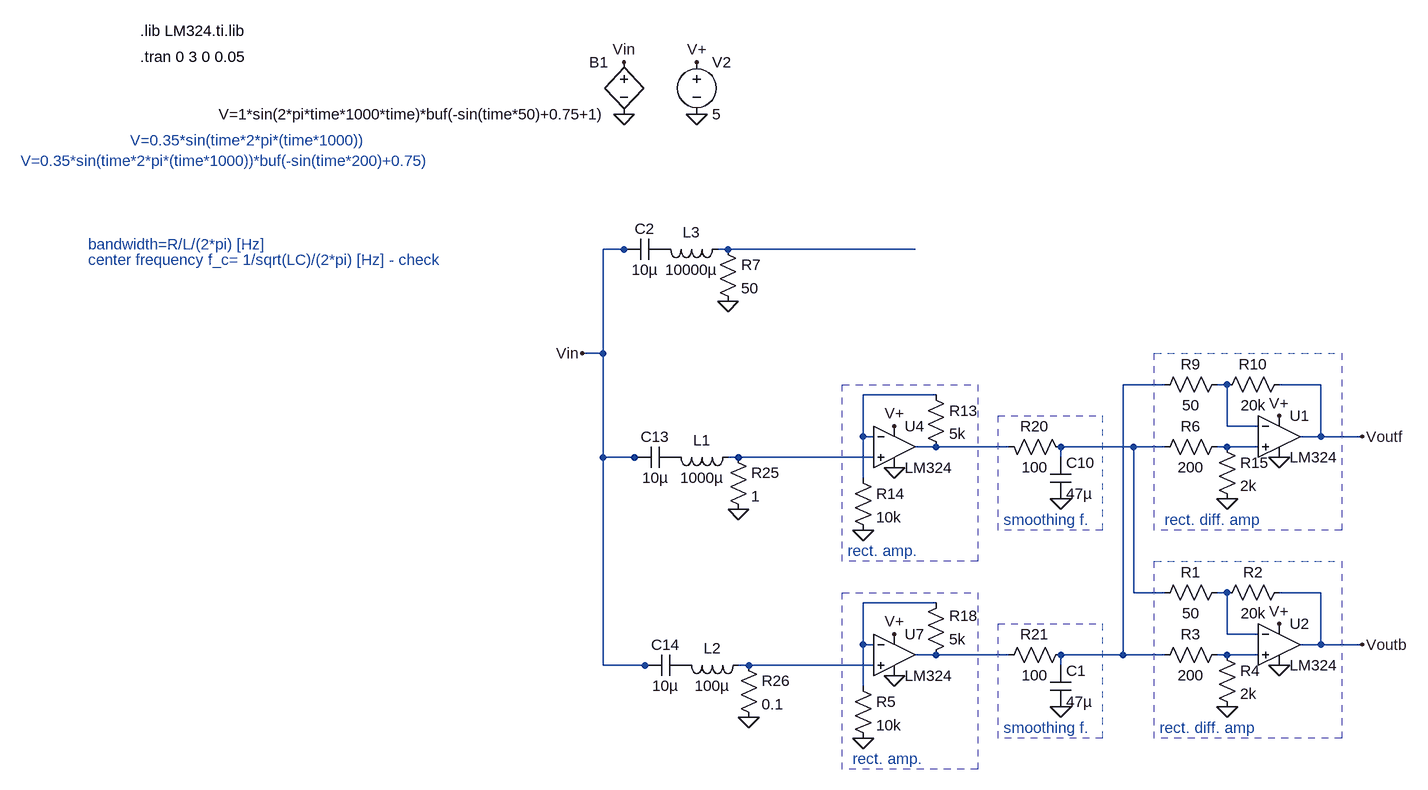
[diagram p0: schematic circuit-rlc.asc]
circuit-rlc.asc, the LTspice schematic file:
Version 4
SHEET 1 1988 1492
WIRE -336 64 -368 64
WIRE -320 64 -336 64
WIRE -176 64 -192 64
WIRE 112 64 -176 64
WIRE -368 224 -368 64
WIRE -368 224 -400 224
WIRE 496 272 432 272
WIRE 592 272 576 272
WIRE 736 272 672 272
WIRE 144 288 32 288
WIRE 592 336 592 272
WIRE 640 336 592 336
WIRE 32 352 32 288
WIRE 48 352 32 352
WIRE 736 352 736 272
WIRE 736 352 704 352
WIRE 800 352 736 352
WIRE 144 368 112 368
WIRE 256 368 144 368
WIRE 448 368 336 368
WIRE 496 368 448 368
WIRE 592 368 576 368
WIRE 640 368 592 368
WIRE -368 384 -368 224
WIRE -320 384 -368 384
WIRE -304 384 -320 384
WIRE -160 384 -176 384
WIRE 48 384 -160 384
WIRE 336 384 336 368
WIRE 32 416 32 352
WIRE 448 592 448 368
WIRE 496 592 448 592
WIRE 592 592 576 592
WIRE 736 592 672 592
WIRE 144 608 32 608
WIRE 592 656 592 592
WIRE 640 656 592 656
WIRE 32 672 32 608
WIRE 48 672 32 672
WIRE 736 672 736 592
WIRE 736 672 704 672
WIRE 800 672 736 672
WIRE 144 688 112 688
WIRE 256 688 144 688
WIRE 432 688 432 272
WIRE 432 688 336 688
WIRE 496 688 432 688
WIRE 592 688 576 688
WIRE 640 688 592 688
WIRE -368 704 -368 384
WIRE -304 704 -368 704
WIRE -288 704 -304 704
WIRE -144 704 -160 704
WIRE 48 704 -144 704
WIRE 336 704 336 688
WIRE 32 736 32 672
FLAG -336 -144 0
FLAG -224 -144 0
FLAG -224 -224 V+
FLAG 80 400 0
FLAG 32 496 0
FLAG 80 336 V+
FLAG 80 720 0
FLAG 32 816 0
FLAG 80 656 V+
FLAG 336 448 0
FLAG 336 768 0
FLAG 672 384 0
FLAG 672 320 V+
FLAG 800 352 Voutf
FLAG 592 448 0
FLAG 672 704 0
FLAG 672 640 V+
FLAG 800 672 Voutb
FLAG 592 768 0
FLAG -336 -224 Vin
FLAG -400 224 Vin
FLAG -160 464 0
FLAG -144 784 0
FLAG -176 144 0
SYMBOL voltage -224 -240 R0
WINDOW 123 0 0 Left 2
WINDOW 39 0 0 Left 2
SYMATTR InstName V2
SYMATTR Value 5
SYMBOL bv -336 -240 M0
SYMATTR InstName B1
SYMATTR Value V=1*sin(2*pi*time*1000*time)*buf(-sin(time*50)+0.75+1)
SYMBOL Opamps\\opamp2 80 304 R0
SYMATTR InstName U4
SYMATTR Value LM324
SYMBOL res 128 272 R0
SYMATTR InstName R13
SYMATTR Value 5k
SYMBOL res 16 400 R0
SYMATTR InstName R14
SYMATTR Value 10k
SYMBOL Opamps\\opamp2 80 624 R0
SYMATTR InstName U7
SYMATTR Value LM324
SYMBOL res 128 704 M180
WINDOW 0 36 76 Left 2
WINDOW 3 36 40 Left 2
SYMATTR InstName R18
SYMATTR Value 5k
SYMBOL res 352 384 M270
WINDOW 0 32 56 VTop 2
WINDOW 3 0 56 VBottom 2
SYMATTR InstName R20
SYMATTR Value 100
SYMBOL cap 320 448 M180
WINDOW 0 24 56 Left 2
WINDOW 3 24 8 Left 2
SYMATTR InstName C10
SYMATTR Value 47µ
SYMBOL res 352 672 R90
WINDOW 0 0 56 VBottom 2
WINDOW 3 32 56 VTop 2
SYMATTR InstName R21
SYMATTR Value 100
SYMBOL res 16 720 R0
SYMATTR InstName R5
SYMATTR Value 10k
SYMBOL Opamps\\opamp2 672 288 R0
SYMATTR InstName U1
SYMATTR Value LM324
SYMBOL res 592 256 R90
WINDOW 0 0 56 VBottom 2
WINDOW 3 32 56 VTop 2
SYMATTR InstName R9
SYMATTR Value 50
SYMBOL res 688 256 R90
WINDOW 0 0 56 VBottom 2
WINDOW 3 32 56 VTop 2
SYMATTR InstName R10
SYMATTR Value 20k
SYMBOL res 576 352 R0
SYMATTR InstName R15
SYMATTR Value 2k
SYMBOL Opamps\\opamp2 672 608 R0
SYMATTR InstName U2
SYMATTR Value LM324
SYMBOL res 592 576 R90
WINDOW 0 0 56 VBottom 2
WINDOW 3 32 56 VTop 2
SYMATTR InstName R1
SYMATTR Value 50
SYMBOL res 688 576 R90
WINDOW 0 0 56 VBottom 2
WINDOW 3 32 56 VTop 2
SYMATTR InstName R2
SYMATTR Value 20k
SYMBOL res 592 672 R90
WINDOW 0 0 56 VBottom 2
WINDOW 3 32 56 VTop 2
SYMATTR InstName R3
SYMATTR Value 200
SYMBOL res 576 672 R0
SYMATTR InstName R4
SYMATTR Value 2k
SYMBOL res 592 352 R90
WINDOW 0 0 56 VBottom 2
WINDOW 3 32 56 VTop 2
SYMATTR InstName R6
SYMATTR Value 200
SYMBOL cap 320 704 R0
SYMATTR InstName C1
SYMATTR Value 47µ
SYMBOL cap -256 368 R90
WINDOW 0 0 32 VBottom 2
WINDOW 3 32 32 VTop 2
SYMATTR InstName C13
SYMATTR Value 10µ
SYMBOL ind -160 368 R90
WINDOW 0 5 56 VBottom 2
WINDOW 3 32 56 VTop 2
SYMATTR InstName L1
SYMATTR Value 1000µ
SYMBOL res -176 368 R0
SYMATTR InstName R25
SYMATTR Value 1
SYMBOL cap -240 688 R90
WINDOW 0 0 32 VBottom 2
WINDOW 3 32 32 VTop 2
SYMATTR InstName C14
SYMATTR Value 10µ
SYMBOL ind -144 688 R90
WINDOW 0 5 56 VBottom 2
WINDOW 3 32 56 VTop 2
SYMATTR InstName L2
SYMATTR Value 100µ
SYMBOL res -160 688 R0
SYMATTR InstName R26
SYMATTR Value 0.1
SYMBOL cap -272 48 R90
WINDOW 0 0 32 VBottom 2
WINDOW 3 32 32 VTop 2
SYMATTR InstName C2
SYMATTR Value 10µ
SYMBOL ind -176 48 R90
WINDOW 0 5 56 VBottom 2
WINDOW 3 32 56 VTop 2
SYMATTR InstName L3
SYMATTR Value 10000µ
SYMBOL res -192 48 R0
SYMATTR InstName R7
SYMATTR Value 50
TEXT -1080 -272 Left 2 !.lib LM324.ti.lib
TEXT -1080 -232 Left 2 !.tran 0 3 0 0.05
TEXT -1096 -104 Left 2 ;V=0.35*sin(time*2*pi*(time*1000))
TEXT -1264 -72 Left 2 ;V=0.35*sin(time*2*pi*(time*1000))*buf(-sin(time*200)+0.75)
TEXT 8 528 Left 2 ;rect. amp.
TEXT 16 848 Left 2 ;rect. amp.
TEXT 248 480 Left 2 ;smoothing f.
TEXT 248 800 Left 2 ;smoothing f.
TEXT 496 480 Left 2 ;rect. diff. amp
TEXT 488 800 Left 2 ;rect. diff. amp
TEXT -1160 56 Left 2 ;bandwidth=R/L/(2*pi) [Hz]
TEXT -1160 80 Left 2 ;center frequency f_c= 1/sqrt(LC)/(2*pi) [Hz] - check
LINE Normal 0 544 0 272 2
LINE Normal 208 544 0 544 2
LINE Normal 208 272 208 544 2
LINE Normal 0 272 208 272 2
LINE Normal 0 864 0 592 2
LINE Normal 208 864 0 864 2
LINE Normal 208 592 208 864 2
LINE Normal 0 592 208 592 2
LINE Normal 240 496 240 320 2
LINE Normal 400 496 240 496 2
LINE Normal 400 320 400 496 2
LINE Normal 240 320 400 320 2
LINE Normal 240 816 240 640 2
LINE Normal 400 816 240 816 2
LINE Normal 400 640 400 816 2
LINE Normal 240 640 400 640 2
LINE Normal 480 496 480 224 2
LINE Normal 768 496 480 496 2
LINE Normal 768 224 768 496 2
LINE Normal 480 224 768 224 2
LINE Normal 480 816 480 544 2
LINE Normal 768 816 480 816 2
LINE Normal 768 544 768 816 2
LINE Normal 480 544 768 544 2

The netlist it stands for:
* circuit-rlc.asc
V2 V+ 0 5
B1 Vin 0 V=1*sin(2*pi*time*1000*time)*buf(-sin(time*50)+0.75+1)
XU4 N008 N004 V+ 0 N005 LM324  ; pins In+ In- V+ V- OUT
R13 N004 N005 5k
R14 N004 0 10k
XU7 N013 N010 V+ 0 N011 LM324  ; pins In+ In- V+ V- OUT
R18 N011 N010 5k
R20 N006 N005 100
C10 0 N006 47µ
R21 N002 N011 100
R5 N010 0 10k
XU1 N007 N003 V+ 0 Voutf LM324  ; pins In+ In- V+ V- OUT
R9 N003 N002 50
R10 Voutf N003 20k
R15 N007 0 2k
XU2 N012 N009 V+ 0 Voutb LM324  ; pins In+ In- V+ V- OUT
R1 N009 N006 50
R2 Voutb N009 20k
R3 N012 N002 200
R4 N012 0 2k
R6 N007 N006 200
C1 N002 0 47µ
C13 P001 Vin 10µ
L1 N008 P001 1000µ
R25 N008 0 1
C14 P002 Vin 10µ
L2 N013 P002 100µ
R26 N013 0 0.1
C2 P003 Vin 10µ
L3 N001 P003 10000µ
R7 N001 0 50
.lib LM324.ti.lib
.tran 0 3 0 0.05
* V=0.35*sin(time*2*pi*(time*1000))
* V=0.35*sin(time*2*pi*(time*1000))*buf(-sin(time*200)+0.75)
* rect. amp.
* rect. amp.
* smoothing f.
* smoothing f.
* rect. diff. amp
* rect. diff. amp
* bandwidth=R/L/(2*pi) [Hz]
* center frequency f_c= 1/sqrt(LC)/(2*pi) [Hz] - check
.backanno
.end